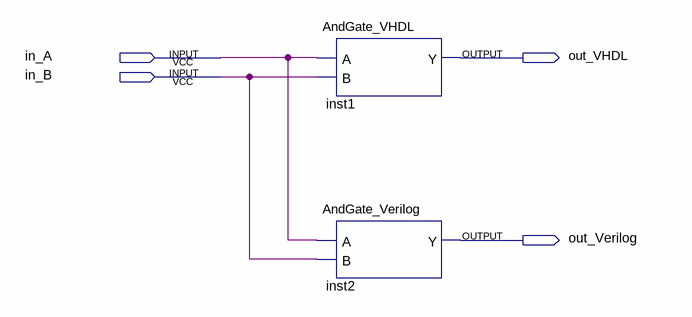
[diagram p0: schematic sheet]
// Quartus schematic Schem_1_1.bdf as structural Verilog: 2 symbols, 4 pins
module Schem_1_1 (
  input  in_A,
  input  in_B,
  output out_VHDL,
  output out_Verilog
);

  AndGate_VHDL inst1 (.A(in_A), .B(in_B), .Y(out_VHDL));
  AndGate_Verilog inst2 (.A(in_A), .B(in_B), .Y(out_Verilog));
endmodule
